# Altium schematic sheet power.SchDoc
size A4
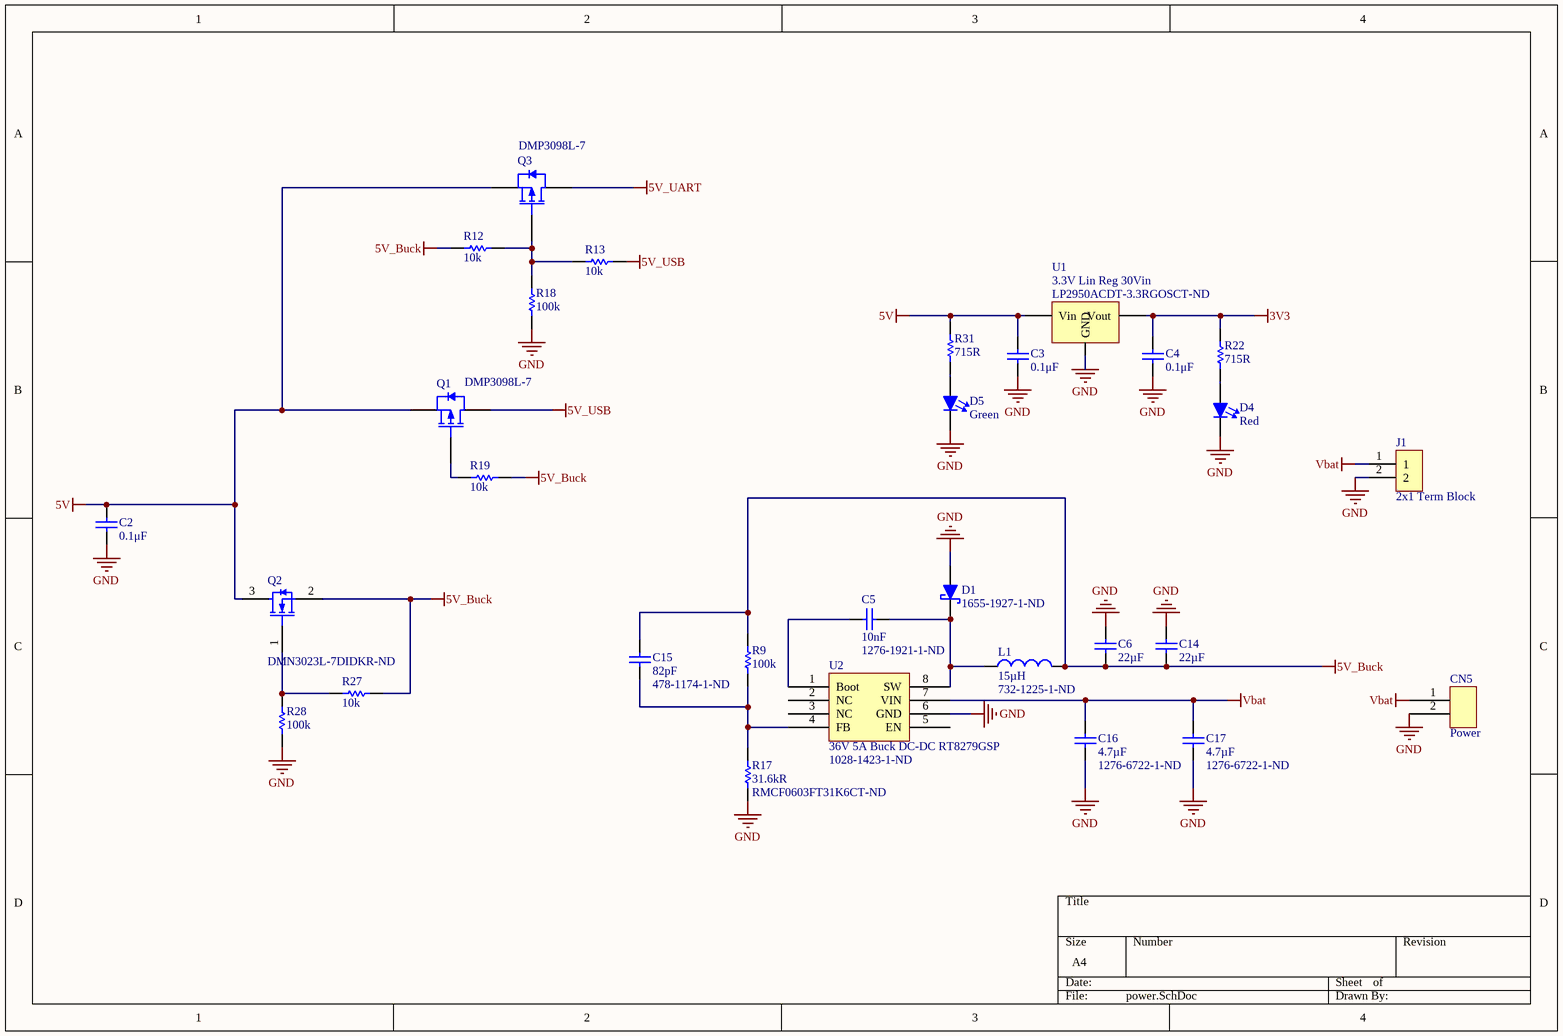
[diagram p0: power.SchDoc]

## Parts
C2  0.1μF  [CAPC1608N(0603")]
C3  0.1μF  [CAPC1608N(0603")]
C4  0.1μF  [CAPC1608N(0603")]
C5  10nF  Supplier Part Number 1: 1276-1921-1-ND  [CAPC1608N(0603")]
C6  22µF  [CAPC2012N(0805")]
C14  22µF  [CAPC2012N(0805")]
C15  82pF  Supplier Part Number 1: 478-1174-1-ND  [CAPC1608N(0603")]
C16  4.7µF  Supplier Part Number 1: 1276-6722-1-ND  [CAPC2012N(0805")]
C17  4.7µF  Supplier Part Number 1: 1276-6722-1-ND  [CAPC2012N(0805")]
CN5  Power  [2X1 Power Connector 90 degrees]
D1  Supplier Part Number 1: 1655-1927-1-ND  [SOD-123F]  (hidden comment: DSS14UTR)
D4  Red  [LED0805]
D5  Green  [LED0805]
J1  2x1 Term Block  [2X1 Terminal Blocks]
L1  15µH  Supplier Part Number 1: 732-1225-1-ND  [WE-PD-XL]
Q1  DMP3098L-7  [DIOD-SOT23-3_V]
Q2  Supplier Part Number 1: DMN3023L-7DIDKR-ND  [SOT-23]  (hidden comment: MOSFET N-Channel, 30V, 6.2A,)
Q3  DMP3098L-7  [DIOD-SOT23-3_V]
R9  100k  [RESC1608N(0603")]
R12  10k  [RESC1608N(0603")]
R13  10k  [RESC1608N(0603")]
R17  31.6kR  Supplier Part Number 1: RMCF0603FT31K6CT-ND  [RESC1608N(0603")]
R18  100k  [RESC1608N(0603")]
R19  10k  [RESC1608N(0603")]
R22  715R  [RESC1608N(0603")]
R27  10k  [RESC1608N(0603")]
R28  100k  [RESC1608N(0603")]
R31  715R  [RESC1608N(0603")]
U1  3.3V Lin Reg 30Vin  Supplier Part Number 1: LP2950ACDT-3.3RGOSCT-ND  [T0-252]
U2  36V 5A Buck DC-DC RT8279GSP  Supplier Part Number 3: 1028-1423-1-ND  [8-SOP-EP]

## Nets
3V3: C4.2(Cathode) R22.2 U1.3(Vout)
5V: C2.2(Cathode) C3.2(Cathode) Q1.2(S) Q2.3(Drain) Q3.2(S) R31.2 U1.2(Vin)
5V_Buck: C6.1(Anode) C14.1(Anode) C15.2 L1.2 Q2.2(Source) R9.2 R12.1 R19.2 R27.2
5V_UART: Q3.3(D)
5V_USB: Q1.3(D) R13.2
GND: C2.1(Anode) C3.1(Anode) C4.1(Anode) C6.2(Cathode) C14.2(Cathode) C16.2(Cathode) C17.2(Cathode) CN5.2 D1.A(Anode) D4.1(Cathode) D5.1(Cathode) J1.2 R17.1 R18.1 R28.1 U1.1(GND) U2.6(GND)
Vbat: C16.1(Anode) C17.1(Anode) CN5.1 J1.1 U2.7(VIN)
NetC5_1: C5.1(Anode) D1.K(Cathode) L1.1 U2.8(SW)
NetC5_2: C5.2(Cathode) U2.1(Boot)
NetC15_1: C15.1 R9.1 R17.2 U2.4(FB)
NetD4_2: D4.2(Anode) R22.1
NetD5_2: D5.2(Anode) R31.1
NetQ1_1: Q1.1(G) R19.1
NetQ2_1: Q2.1(Gate) R27.1 R28.2
NetQ3_1: Q3.1(G) R12.2 R13.1 R18.2

Not connected (* = marked no-connect by the designer): U2 2(NC) 3(NC) 5(EN)

## Library data of the parts
C2-C4 = 0.1uF 100V 0603 SMD, Ceramic: Capacitor, Ceramic, 100V, +/- 10%, 0603 SMD, X7R; MFG: TDK; MFG#: CGA3E3X7S2A104K080AB; Published: 16-04-26; Publisher: AUVic; PackageDescription: Chip Capacitor; Value: 0.1μF; Created By: Ashwin Sira; Supplier 1: Digi-Key; Supplier Part Number 1: 445-6938-1-ND
C5 = 10 nF, 50V 0603 SMD, Ceramic: Capacitor, Ceramic, 50V, +/- 10%, 0603 SMD; MFG: Samsung; MFG#: GRM188R61A475KE15D; Published: 16-06-23; Publisher: AUVic; PackageDescription: Chip Capacitor; Value: 10nF; Created By: Gabriel; Supplier 1: Digi-Key
C6 C14 = 22uF 35V 0805 SMD, Ceramic: Capacitor, Ceramic, 35V, +/- 20%, 0805 SMD, X5R; Published: 14-06-01; Publisher: AUVic; PackageDescription: Chip Capacitor; Value: 22µF; Supplier 1: Digi-Key; Supplier Part Number 1: 445-14428-1-ND
C15 = 82pF 50V 0603 SMD, Ceramic: 82pF 50V Ceramic Capacitor C0G, NP0 0603; Value: 82pF; Created By: Robert Keen; Created On: 2018-07-18; ComponentLink1Description: Digikey; ComponentLink1URL: https://www.digikey.ca/product-detail/en/avx-corporation/06035A820JAT2A/478-1174-1-ND/564206; Supplier 1: Digi-Key
C16 C17 = 4.7uF 35V 0805 SMD, Ceramic: Capacitor, Ceramic, 35V, +/- 10%, 0805 SMD, X5R; Made By: Andy Bates; Published: 16-11-12; Publisher: AUVic; PackageDescription: Chip Capacitor; Value: 4.7µF; Supplier 1: Digi-Key
CN5 = 2x1, Male header, Right Angle, Latch holder: Connector Header Through Hole, Right Angle 2 position 0.312" (7.92mm); Made by: Robert Keen; ComponentLink1Description: Digikey (male); ComponentLink1URL: https://www.digikey.ca/product-detail/en/hirose-electric-co-ltd/DF22R-2P-7.92DS-05/H10706-ND/1025057; ComponentLink2Description: Digikey (female); ComponentLink2URL: https://www.digikey.ca/product-detail/en/hirose-electric-co-ltd/DF22R-2S-7.92C-28/H1615-ND/510248; ComponentLink3Description: Digikey (crimp); ComponentLink3URL: https://www.digikey.ca/product-detail/en/hirose-electric-co-ltd/DF22-1416SCF/H2788CT-ND/365031; Made on: 2018-08-16; Supplier 3: Digi-Key; Supplier Part Number 1: H10706-ND; Supplier Part Number 2: H1615-ND; Supplier Part Number 3: H2788CT-ND; Supplier 2: Digi-Key; Supplier 1: Digi-Key
D1 = DSS14UTR: Diode, Schottky, 40V, 1A; Created By: Robert Keen; Publisher: AUVic; Date Created: 2018-07-11; ComponentLink1Description: Digikey; ComponentLink1URL: https://www.digikey.ca/product-detail/en/smc-diode-solutions/DSS14UTR/1655-1927-1-ND/8341869; Supplier 1: Digi-Key
D4 = LED, 0805 (2012), Red, Clear: Supplier 1: Digi-Key; Supplier Part Number 1: 732-4984-1-ND; Colour: Red; Created By: Ashwin Sira
D5 = LED, 0805 (2012), Green, Clear: Colour: Green; Created By: Andy Bates; Supplier 1: Digi-Key; Supplier Part Number 1: 475-1410-1-ND
J1 = 2x1 Terminal Block: Made by: Andy Bates; Supplier 1: Digikey; Supplier Part Number 1: ED2740-ND
L1 = 15µH 5A Inductor: 15µH Shielded Wirewound Inductor 5A 27 mOhm Max Nonstandard; Created By: Robert Keen; Created On: 2018-06-13; Value: 15µH; ComponentLink1Description: Digikey; ComponentLink1URL: https://www.digikey.ca/product-detail/en/wurth-electronics-inc/744770115/732-1225-1-ND/1639286; Supplier 1: Digi-Key
Q1 Q3 = CMP-0697-00001-2: P-Channel Enhancement Mode MOSFET, -30 V VDS, -55 to 155 degC, 3-Pin SOT23, RoHS, Tape and Reel; Manufacturer: Diodes Inc; PD (TA: 25 degC)=1.08 W; VGS: +/- 20 V; VDS: -30 V; IDS (TA: 25 degC)=-3.8 A; RDS(on) (Max.) (VGS: 4.5 V)=120 mOhm; VGS(th) (Max.): -2.1 V; ComponentLink3Description: Package Specification; ComponentLink3URL: http://www.diodes.com/datasheets/ap02002.pdf; PackageDescription: 3-Pin Small Outline Transistor, Body 1.3 x 2.9 mm, Pitch 0.95 mm; PackageReference: SOT23; PartNumber: DMP3098L-7; ComponentLink1Description: Manufacturer URL; ComponentLink2Description: Datasheet; ComponentLink2URL: http://www.diodes.com/datasheets/ds31447.pdf; ComponentLink1URL: http://www.diodes.com/; DatasheetVersion: Rev. 8 - 2; Mounting Technology: Surface Mount; RoHS: TRUE; Packing: Tape and Reel; PackageVersion: Rev. 75; Operating Temperature Range: -55 to 150 degC
Q2 = MOSFET N-Channel, 30V, 6.2A,: N-Channel 30V 6.2A (Ta) 900mW (Ta) Surface Mount SOT-23; Supplier 1: Digi-Key; Created By: Poorna Chander Kalidas; ComponentLink1Description: Digi-Key; ComponentLink1URL: https://www.digikey.ca/product-detail/en/diodes-incorporated/DMN3023L-7/DMN3023L-7DICT-ND/5453155
R9 R18 R28 = 100kR, 1%, 1/10W, 0603 SMD: Made By: Andy Bates; Owned By: AUVic; Created On: 14-06-30; Last Edited: 14-06-30; Value: 100k; Supplier 1: Digi-Key; Supplier Part Number 1: 311-100KGRCT-ND
R12 R13 R19 R27 = 10kR, 1%, 1/10W, 0603 SMD: Made By: Ashwin Sira; Owned By: AUVic; Created On: 14-05-31; Last Edited: 14-05-31; Supplier 1: Digi-Key; Supplier Part Number 1: 311-10.0KHRCT-ND; Value: 10k
R17 = 31.6kR, 1%, 1/10W, 0603, SMD: Created By: Robert Keen; Date Created: 2018-07-18; Value: 31.6kR; ComponentLink1Description: Digikey; ComponentLink1URL: https://www.digikey.ca/product-detail/en/stackpole-electronics-inc/RMCF0603FT31K6/RMCF0603FT31K6CT-ND/1943089; Supplier 1: Digi-Key
R22 R31 = 715R, 1%, 1/10W, 0603, SMD: Created By: Ashwin Sira; Publisher: AUVic; Date Created: 2016-06-10; Value: 715R; Supplier 1: Digi-Key; Supplier Part Number 1: 541-715HCT-ND
U1 = 3.3V TO-252 Linear Regulator: Supplier 1: Digi-Key
U2 = 36V 5A Buck DC-DC RT8279GSP: Made by: Robert Keen; Supplier 1: Digi-Key; Made on: 2017-07-18; Supplier 2: Digi-Key; ComponentLink1Description: Digikey; ComponentLink1URL: https://www.digikey.ca/product-detail/en/richtek-usa-inc/RT8279GSP/1028-1423-1-ND/5880353; Supplier 3: Digi-Key